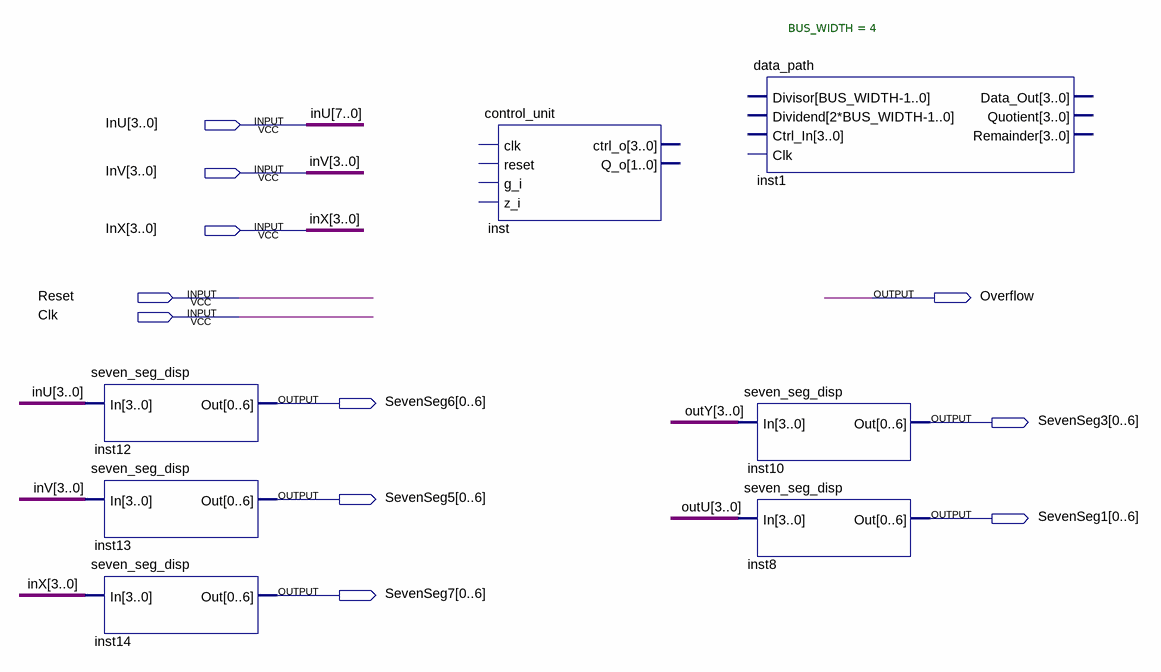
[diagram p0: schematic sheet]
// Quartus schematic shift_sub_div_alt.bdf as structural Verilog: 7 symbols, 11 pins
module shift_sub_div_alt (
  input  [3:0] InU,
  input  [3:0] InV,
  input  [3:0] InX,
  input  Reset,
  input  Clk,
  output Overflow,
  output [0:6] SevenSeg6,
  output [0:6] SevenSeg3,
  output [0:6] SevenSeg5,
  output [0:6] SevenSeg1,
  output [0:6] SevenSeg7
);

  wire [3:0] outU, outY;

  seven_seg_disp inst12 (.In(InU), .Out(SevenSeg6));
  seven_seg_disp inst13 (.In(InV), .Out(SevenSeg5));
  seven_seg_disp inst14 (.In(InX), .Out(SevenSeg7));
  control_unit inst ();  // open: clk, reset, g_i, z_i, ctrl_o, Q_o
  data_path #(.BUS_WIDTH(4)) inst1 ();  // open: Divisor, Dividend, Ctrl_In, Clk, Data_Out, Quotient, Remainder
  seven_seg_disp inst10 (.In(outY), .Out(SevenSeg3));
  seven_seg_disp inst8 (.In(outU), .Out(SevenSeg1));
endmodule
